# EAGLE design Programmer (EAGLE 9.6.2)
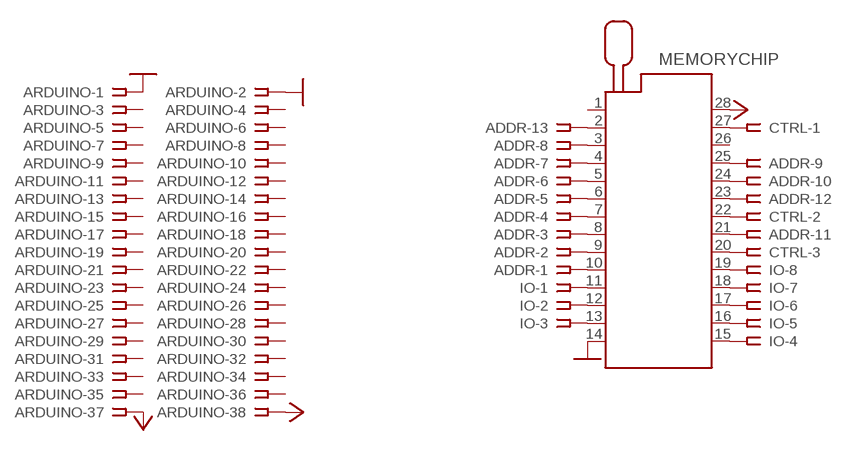
[diagram p0: schematic, sheet 1]

## Parts
ADDR  SSW-113-02-G-S-RA  [SSW-113-02-G-S-RA]
ARDUINO  SSW-119-02-G-D  [SSW-119-02-G-D]
CTRL  SSW-103-02-G-S-RA  [SSW-103-02-G-S-RA]
IO  SSW-108-02-G-S-RA  [SSW-108-02-G-S-RA]
MEMORYCHIP  228-1277-00-0602J  [228-1277-00-0602J]

## Nets
GND: ARDUINO.1 ARDUINO.2 MEMORYCHIP.14
N$1: IO.1 MEMORYCHIP.11
N$2: IO.2 MEMORYCHIP.12
N$3: IO.3 MEMORYCHIP.13
N$4: IO.4 MEMORYCHIP.15
N$5: IO.5 MEMORYCHIP.16
N$6: IO.6 MEMORYCHIP.17
N$7: IO.7 MEMORYCHIP.18
N$8: IO.8 MEMORYCHIP.19
N$9: ADDR.1 MEMORYCHIP.10
N$10: ADDR.2 MEMORYCHIP.9
N$11: ADDR.3 MEMORYCHIP.8
N$12: ADDR.4 MEMORYCHIP.7
N$13: ADDR.5 MEMORYCHIP.6
N$14: ADDR.6 MEMORYCHIP.5
N$15: ADDR.7 MEMORYCHIP.4
N$16: ADDR.8 MEMORYCHIP.3
N$17: ADDR.9 MEMORYCHIP.25
N$18: ADDR.10 MEMORYCHIP.24
N$19: ADDR.11 MEMORYCHIP.21
N$20: ADDR.12 MEMORYCHIP.23
N$21: ADDR.13 MEMORYCHIP.2
N$22: CTRL.1 MEMORYCHIP.27
N$23: CTRL.2 MEMORYCHIP.22
N$24: CTRL.3 MEMORYCHIP.20
VCC: ARDUINO.37 ARDUINO.38 MEMORYCHIP.28
Unconnected: ARDUINO.3 ARDUINO.4 ARDUINO.5 ARDUINO.6 ARDUINO.7 ARDUINO.8 ARDUINO.9 ARDUINO.10 ARDUINO.11 ARDUINO.12 ARDUINO.13 ARDUINO.14 ARDUINO.15 ARDUINO.16 ARDUINO.17 ARDUINO.18 ARDUINO.19 ARDUINO.20 ARDUINO.21 ARDUINO.22 ARDUINO.23 ARDUINO.24 ARDUINO.25 ARDUINO.26 ARDUINO.27 ARDUINO.28 ARDUINO.29 ARDUINO.30 ARDUINO.31 ARDUINO.32 ARDUINO.33 ARDUINO.34 ARDUINO.35 ARDUINO.36 MEMORYCHIP.1 MEMORYCHIP.26

## Library data of the parts
ADDR = con-samtec:SSW-113-02-G-S: THROUGH-HOLE .025" SQ POST SOCKET Source: Samtec SSW.pdf; MF: Samtec Inc.; MPN: SSW-113-02-G-S-RA; OC_FARNELL: unknown; OC_NEWARK: 11P9533
ARDUINO = con-samtec:SSW-119-02-G: THROUGH-HOLE .025" SQ POST SOCKET Source: Samtec SSW.pdf; MF: Samtec Inc.; MPN: SSW-119-02-G-D; OC_FARNELL: unknown; OC_NEWARK: 11P9623
CTRL = con-samtec:SSW-103-02-G-S: THROUGH-HOLE .025" SQ POST SOCKET Source: Samtec SSW.pdf; MF: Samtec Inc.; MPN: SSW-103-02-G-S-RA; OC_FARNELL: unknown; OC_NEWARK: 11P9368
IO = con-samtec:SSW-108-02-G-S: THROUGH-HOLE .025" SQ POST SOCKET Source: Samtec SSW.pdf; MF: Samtec Inc.; MPN: SSW-108-02-G-S-RA; OC_FARNELL: unknown; OC_NEWARK: 11P9449
MEMORYCHIP = con-3m:228-?00-0602J: Zero Insertion Force Socked Source: http://www.3M.com/ehpd; MF: 3M; MPN: 228-1277-00-0602J; OC_FARNELL: 9897356; OC_NEWARK: 85K7825

## Board
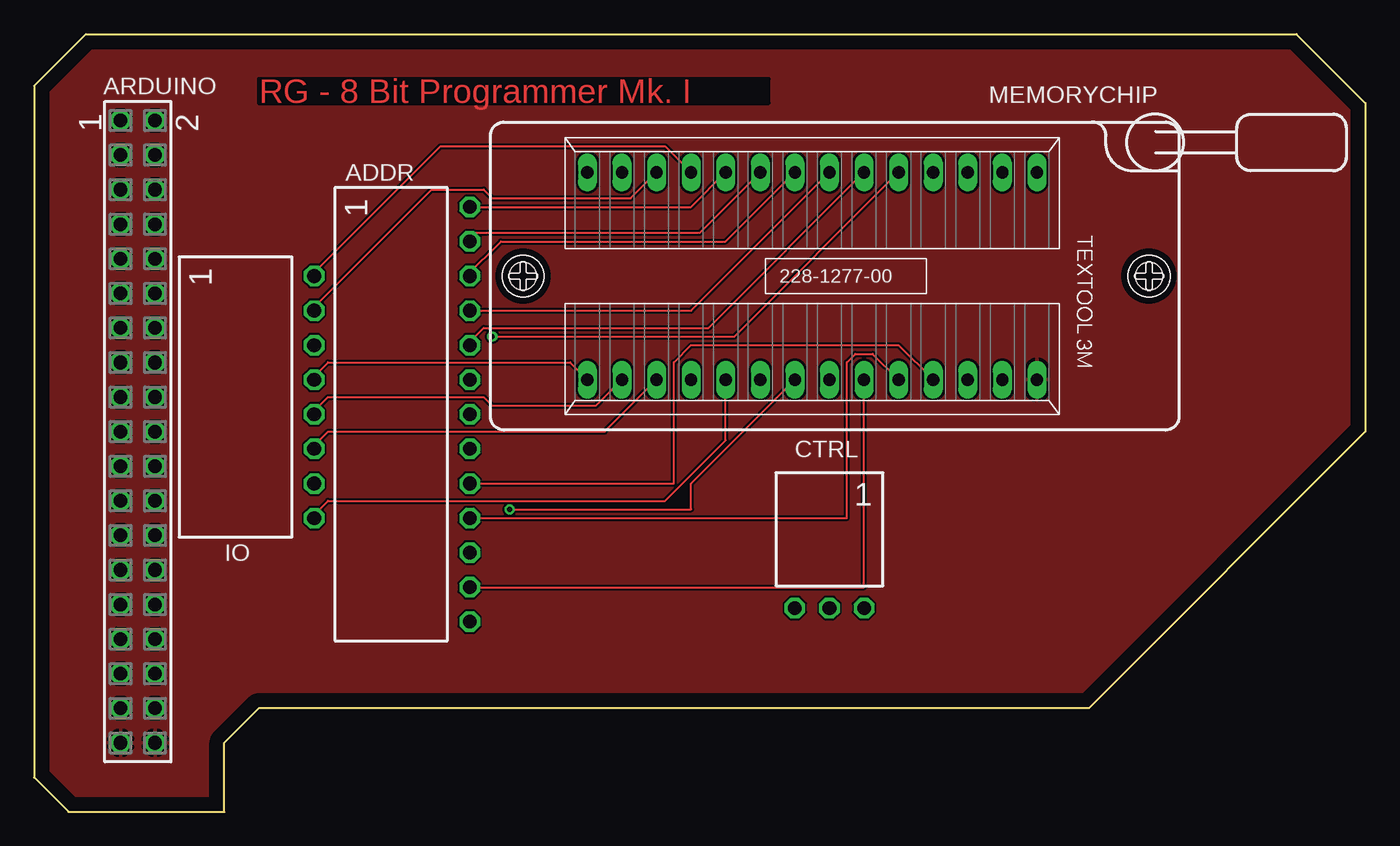
[diagram p1: board, top side]
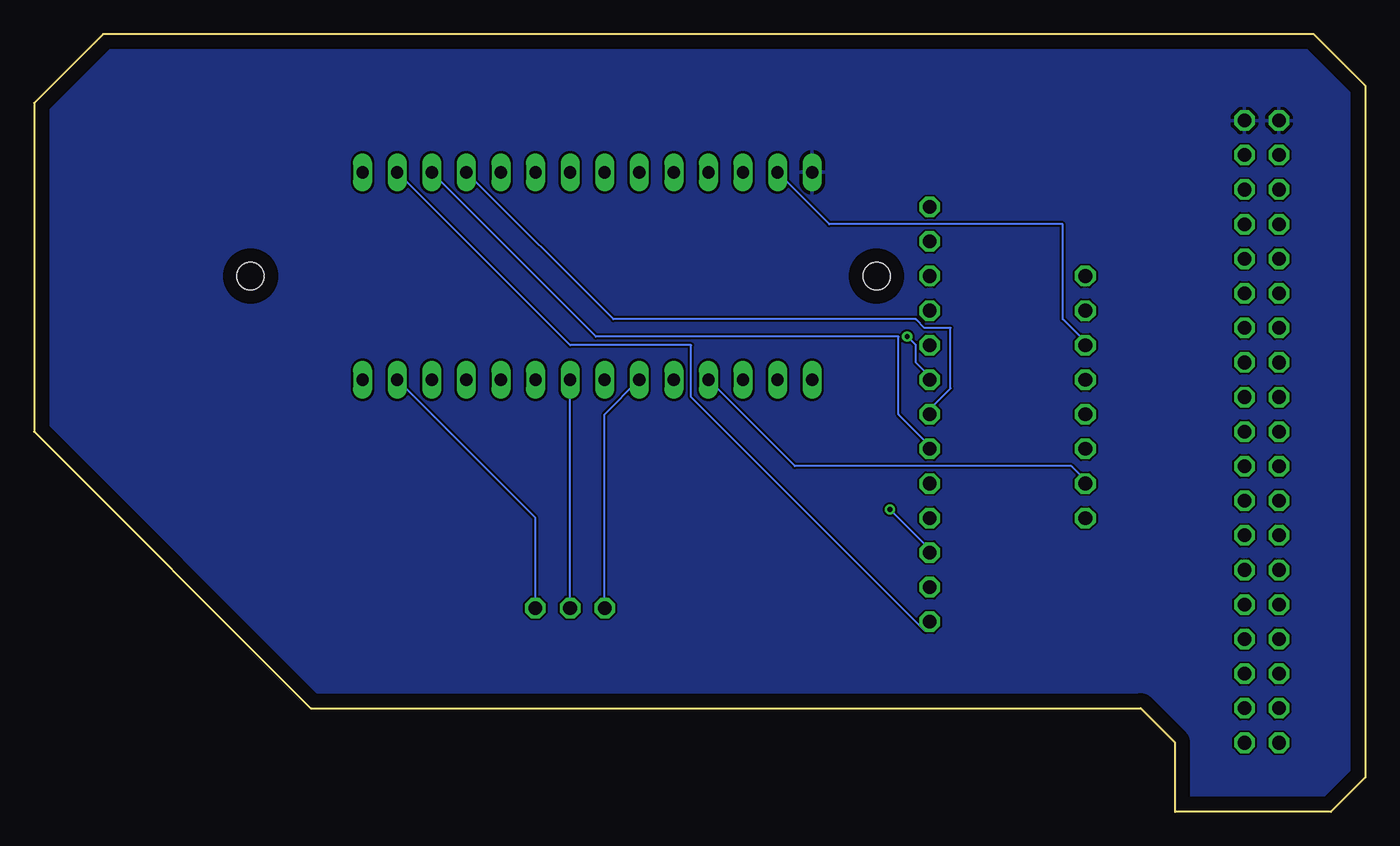
[diagram p2: board, bottom side, seen from below]

Size 97.79 x 57.15 mm. Coordinates in mm from the lower left corner, seen from the top.
Outline: 13.97,0 13.97,5.08 16.51,7.62 77.47,7.62 97.79,27.94 97.79,52.07 92.71,57.15 3.81,57.15 0,53.34 0,2.54 2.54,0 13.97,0
Copper layers (1*16): Top 0.035mm / dielectric 1.5mm / Bottom 0.035mm
Design rules "default": minimum track width 6mil, minimum drill 0.35mm, track to track 6mil, track to pad 6mil, pad to pad 6mil, via to via 6mil, smd to smd 6mil, copper to edge 40mil, drill to drill 6mil, minimum pad ring 10mil, minimum via ring 8mil, stop-mask expansion 4mil, vias tented up to drill 0mil, thermal gap 10mil

### Footprints (pad centres in the part's own frame; a part is rotated, then mirrored left to right if it is on the bottom)
SSW-113-02-G-S-RA = drill 1 pad 1.5 octagon: 1 -15.24,1.524; 2 -12.7,1.524; 3 -10.16,1.524; 4 -7.62,1.524; 5 -5.08,1.524; 6 -2.54,1.524; 7 0,1.524; 8 2.54,1.524; 9 5.08,1.524; 10 7.62,1.524; 11 10.16,1.524; 12 12.7,1.524; 13 15.24,1.524
SSW-119-02-G-D = drill 1 pad 1.5 octagon: 1 -22.86,-1.27; 2 -22.86,1.27; 3 -20.32,-1.27; 4 -20.32,1.27; 5 -17.78,-1.27; 6 -17.78,1.27; 7 -15.24,-1.27; 8 -15.24,1.27; 9 -12.7,-1.27; 10 -12.7,1.27; 11 -10.16,-1.27; 12 -10.16,1.27; 13 -7.62,-1.27; 14 -7.62,1.27; 15 -5.08,-1.27; 16 -5.08,1.27; 17 -2.54,-1.27; 18 -2.54,1.27; 19 0,-1.27; 20 0,1.27; 21 2.54,-1.27; 22 2.54,1.27; 23 5.08,-1.27; 24 5.08,1.27; 25 7.62,-1.27; 26 7.62,1.27; 27 10.16,-1.27; 28 10.16,1.27; 29 12.7,-1.27; 30 12.7,1.27; 31 15.24,-1.27; 32 15.24,1.27; 33 17.78,-1.27; 34 17.78,1.27; 35 20.32,-1.27; 36 20.32,1.27; 37 22.86,-1.27; 38 22.86,1.27
SSW-103-02-G-S-RA = drill 1 pad 1.5 octagon: 1 -2.54,1.524; 2 0,1.524; 3 2.54,1.524
SSW-108-02-G-S-RA = drill 1 pad 1.5 octagon: 1 -8.89,1.524; 2 -6.35,1.524; 3 -3.81,1.524; 4 -1.27,1.524; 5 1.27,1.524; 6 3.81,1.524; 7 6.35,1.524; 8 8.89,1.524
228-1277-00-0602J = drill 0.9 long: 1 -16.51,-7.62; 2 -13.97,-7.62; 3 -11.43,-7.62; 4 -8.89,-7.62; 5 -6.35,-7.62; 6 -3.81,-7.62; 7 -1.27,-7.62; 8 1.27,-7.62; 9 3.81,-7.62; 10 6.35,-7.62; 11 8.89,-7.62; 12 11.43,-7.62; 13 13.97,-7.62; 14 16.51,-7.62; 15 16.51,7.62; 16 13.97,7.62; 17 11.43,7.62; 18 8.89,7.62; 19 6.35,7.62; 20 3.81,7.62; 21 1.27,7.62; 22 -1.27,7.62; 23 -3.81,7.62; 24 -6.35,7.62; 25 -8.89,7.62; 26 -11.43,7.62; 27 -13.97,7.62; 28 -16.51,7.62 | hole 2: 21.24,0; -24.74,0

### Placement (x,y rotation side)
ADDR  30.48,29.21 270 top
ARDUINO  7.62,27.94 270 top
CTRL  58.42,16.51 180 top
IO  19.05,30.48 270 top
MEMORYCHIP  57.15,39.37 180 top

### Tracks (layer width: path | path; a pad name or v marks a point on that pad's centre or on a via)
GND
  pour Bottom: 13.97,0 13.97,5.08 16.51,7.62 77.47,7.62 97.79,27.94 97.79,52.07 92.71,57.15 3.81,57.15 0,53.34 0,2.54 2.54,0
N$1
  Top 0.152: MEMORYCHIP.11 46.35,48.89 29.84,48.89 20.32,39.37 IO.1
N$2
  Top 0.152: MEMORYCHIP.12 43.81,45.09 33.66,45.09 33.02,45.72 29.21,45.72 20.32,36.83 IO.2
N$3
  Bottom 0.152: MEMORYCHIP.13 39.37,43.18 22.23,43.18 22.23,36.2 20.95,34.92 20.95,34.29 IO.3
N$4
  Top 0.152: MEMORYCHIP.15 39.37,33.02 21.59,33.02 20.32,31.75 IO.4
N$5
  Top 0.152: MEMORYCHIP.16 41.27,29.85 33.66,29.85 33.02,30.48 21.59,30.48 20.32,29.21 IO.5
N$6
  Top 0.152: MEMORYCHIP.17 41.91,27.94 21.59,27.94 20.32,26.67 IO.6
N$7
  Bottom 0.152: MEMORYCHIP.18 41.91,25.4 21.59,25.4 20.95,24.77 20.95,24.13 IO.7
N$8
  Top 0.152: MEMORYCHIP.19 50.8,27.3 46.35,22.86 21.59,22.86 20.32,21.59 IO.8
N$9
  Top 0.152: MEMORYCHIP.10 48.26,44.45 ADDR.1
N$10
  Top 0.152: MEMORYCHIP.9 48.9,42.54 32.38,42.54 31.75,41.91 ADDR.2
N$11
  Top 0.152: MEMORYCHIP.8 50.8,41.91 34.29,41.91 31.75,39.37 ADDR.3
N$12
  Top 0.152: MEMORYCHIP.7 48.26,36.83 ADDR.4
N$13
  Top 0.152: MEMORYCHIP.6 49.53,35.56 33.02,35.56 31.75,34.29 ADDR.5
N$14  (via drill 0.35)
  Top 0.152: MEMORYCHIP.5 51.44,34.92 v33.66,34.92
  Bottom 0.152: v33.66,34.92 33.02,34.29 33.02,33.02 32.38,32.38 32.38,31.75 ADDR.6
N$15
  Bottom 0.152: MEMORYCHIP.4 55.24,36.2 33.02,36.2 32.38,35.56 30.48,35.56 30.48,31.11 31.75,29.85 31.75,29.21 ADDR.7
N$16
  Bottom 0.152: MEMORYCHIP.3 56.52,34.92 34.29,34.92 34.29,29.21 32.38,27.3 32.38,26.67 ADDR.8
N$17
  Top 0.152: MEMORYCHIP.25 63.5,34.29 48.26,34.29 46.99,33.02 46.99,24.13 ADDR.9
N$18
  Top 0.152: MEMORYCHIP.24 61.59,33.66 60.33,33.66 59.69,33.02 59.69,21.59 ADDR.10
N$19  (via drill 0.35)
  Top 0.152: MEMORYCHIP.21 48.26,24.13 48.26,22.23 v34.92,22.23
  Bottom 0.152: v34.92,22.23 32.38,19.69 32.38,19.05 ADDR.11
N$20
  Top 0.152: MEMORYCHIP.23 60.96,16.51 ADDR.12
N$21
  Bottom 0.152: MEMORYCHIP.2 58.42,34.29 49.53,34.29 49.53,30.48 32.38,13.33 31.75,13.33 31.75,13.97 ADDR.13
N$22
  Bottom 0.152: MEMORYCHIP.27 60.96,21.59 CTRL.1
N$23
  Bottom 0.152: CTRL.2 MEMORYCHIP.22
N$24
  Bottom 0.152: MEMORYCHIP.20 55.88,29.21 CTRL.3
VCC
  pour Top: 13.97,0 13.97,5.08 16.51,7.62 77.47,7.62 97.79,27.94 97.79,52.07 92.71,57.15 3.81,57.15 0,53.34 0,2.54 2.54,0

### Text on the board
Top: RG - 8 Bit Programmer Mk. I